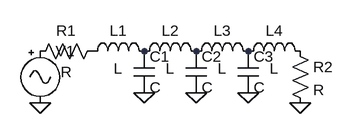
[diagram p0: schematic Draft1.asc]
Draft1.asc, the LTspice schematic file:
Version 4
SHEET 1 880 680
FLAG 160 160 0
FLAG 240 160 0
FLAG 320 160 0
FLAG 400 176 0
FLAG 0 176 0
SYMBOL res 96 80 R90
WINDOW 0 0 56 VBottom 2
WINDOW 3 32 56 VTop 2
SYMATTR InstName R1
SYMBOL Misc\\signal 0 80 R0
WINDOW 123 0 0 Left 2
WINDOW 39 0 0 Left 2
SYMATTR InstName V1
SYMATTR Value ""
SYMBOL ind 64 112 R270
WINDOW 0 32 56 VTop 2
WINDOW 3 5 56 VBottom 2
SYMATTR InstName L1
SYMBOL ind 144 112 R270
WINDOW 0 32 56 VTop 2
WINDOW 3 5 56 VBottom 2
SYMATTR InstName L2
SYMBOL ind 224 112 R270
WINDOW 0 32 56 VTop 2
WINDOW 3 5 56 VBottom 2
SYMATTR InstName L3
SYMBOL ind 304 112 R270
WINDOW 0 32 56 VTop 2
WINDOW 3 5 56 VBottom 2
SYMATTR InstName L4
SYMBOL cap 144 96 R0
SYMATTR InstName C1
SYMBOL cap 224 96 R0
SYMATTR InstName C2
SYMBOL cap 304 96 R0
SYMATTR InstName C3
SYMBOL res 384 80 R0
SYMATTR InstName R2

The netlist it stands for:
* Draft1.asc
R1 P001 P002 R
V1 P002 0
L1 P001 P003 L
L2 P003 P004 L
L3 P004 P005 L
L4 P005 P006 L
C1 P003 0 C
C2 P004 0 C
C3 P005 0 C
R2 P006 0 R
.backanno
.end